# Altium schematic sheet source_test(datasheet).SchDoc
size A4
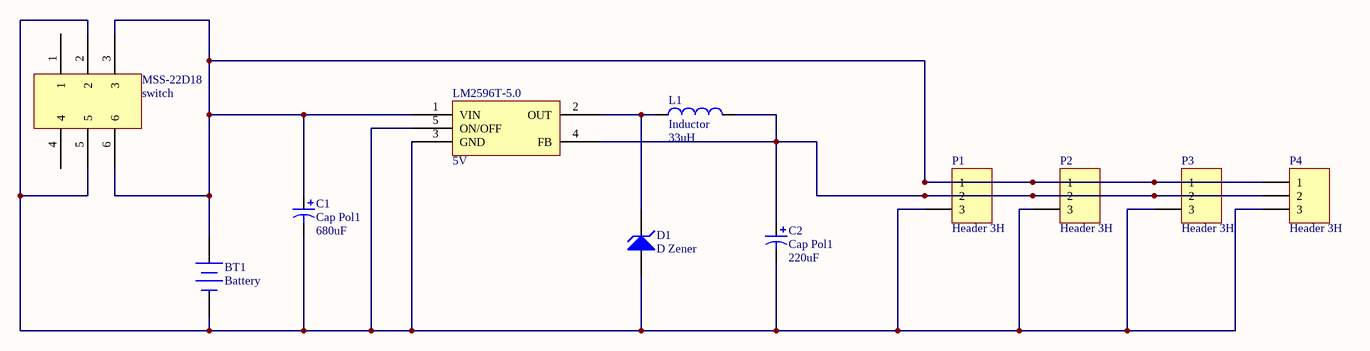
[diagram p0: source_test(datasheet).SchDoc]

## Parts
BT1  Battery  [BAT-2]
C1  Cap Pol1  value 680uF  [RB7.6-15]
C2  Cap Pol1  value 220uF  [RB7.6-15]
D1  D Zener  [DIODE-0.7]
L1  Inductor  value 33uH  [0402-A]
LM2596T-5.0  5V  [LM2596T-5.0]
MSS-22D18  switch  [MSS-22D18]
P1  Header 3H  [HDR1X3H]
P2  Header 3H  [HDR1X3H]
P3  Header 3H  [HDR1X3H]
P4  Header 3H  [HDR1X3H]

## Nets
NetBT1_1: BT1.1(+) C1.1 LM2596T-5.0.1(VIN) MSS-22D18.3 MSS-22D18.6 P1.1 P2.1 P3.1 P4.1
NetBT1_2: BT1.2(-) C1.2 C2.2 D1.1(A) LM2596T-5.0.3(GND) LM2596T-5.0.5(ON/OFF) MSS-22D18.2 MSS-22D18.5 P1.3 P2.3 P3.3 P4.3
NetC2_1: C2.1 L1.2 LM2596T-5.0.4(FB) P1.2 P2.2 P3.2 P4.2
NetD1_2: D1.2(K) L1.1 LM2596T-5.0.2(OUT)

Not connected (* = marked no-connect by the designer): MSS-22D18 1 4

## Library data of the parts
BT1 = Battery: Multicell Battery; Published: 24-Mar-1999; LatestRevisionDate: 17-Jul-2002; LatestRevisionNote: Re-released for DXP Platform.; PackageReference: BAT-2; Publisher: Altium Limited; PackageDescription: Battery; 2 Leads
C1 C2 = Cap Pol1: Polarized Capacitor (Radial); Published: 8-Jun-2000; LatestRevisionDate: 17-Jul-2002; LatestRevisionNote: Re-released for DXP Platform.; PackageReference: RB7.6-15; Publisher: Altium Limited; PackageDescription: Polarized Capacitor (Radial); 2 Leads
D1 = D Zener: Zener Diode; Published: 8-Jun-2000; LatestRevisionDate: 17-Jul-2002; LatestRevisionNote: Re-released for DXP Platform.; PackageReference: DIODE-0.7; Publisher: Altium Limited; PackageDescription: Diode, Thru-Hole; 2 Leads; 0.7 in Pin Spacing
L1 = Inductor: Code_IEC: 1005; Published: 8-Jun-2000; LatestRevisionDate: 29-May-2009; LatestRevisionNote: IPC-7351 Footprint Added.; PackageReference: 0402-A; Publisher: Altium Limited; PackageDescription: Chip Inductor; Code_JEITA: 0402
LM2596T-5.0 = LM2596T-5.0
MSS-22D18 = MSS-22D18
P1-P4 = Header 3H: Header, 3-Pin, Right Angle; LatestRevisionDate: 17-Jul-2002; LatestRevisionNote: Re-released for DXP Platform.; Publisher: Altium Limited